# Altium schematic sheet 1_panel.schdoc: Solar Cells
size A4; Engineer: Eng_2_ALT; SheetNumber: 2; SheetTotal: 2; Designed by: Marina Duailibe; Version: v0.1
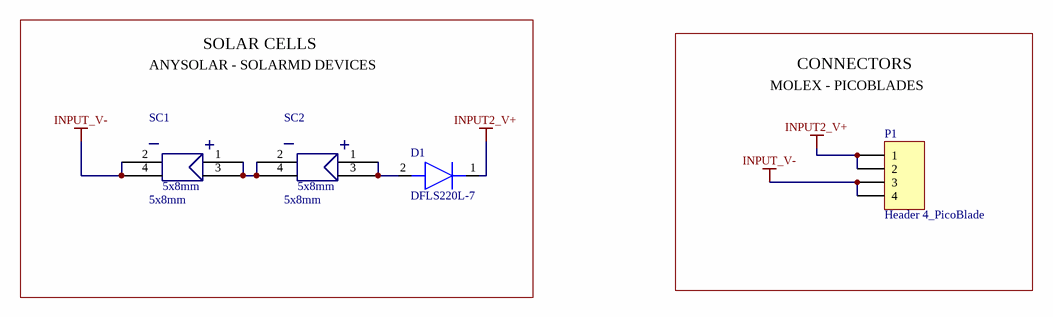
[diagram p0: 1_panel.schdoc]

## Parts
D1  DFLS220L-7  [DFLS220L7]
P1  Header 4_PicoBlade  [PICOBLADE 4PIN VERTICAL - duplicate]
SC1  5x8mm  [SOLAR_CELL]
SC2  5x8mm  [SOLAR_CELL]

## Blocks framed on the sheet
SOLAR CELLS: D1 SC1 SC2
CONNECTORS: P1

## Nets
INPUT2_V+: D1.1(K) P1.1 P1.2
INPUT_V-: P1.3 P1.4 SC1.2(V-) SC1.4
NetD1_2: D1.2(A) SC2.1(V+) SC2.3
NetSC1_1: SC1.1(V+) SC1.3 SC2.2(V-) SC2.4

## Notes on the sheet
- ANYSOLAR - SOLARMD DEVICES
- MOLEX - PICOBLADES
- Project:
- SpaceLab - Federal University of Santa Catarina
- Title:
- Designed by:
- Project Code:
- Date:
- Revision:
- Sheet
- of
- Size:
- A4
- (in symbol SOLAR CELL) _; +

## Library data of the parts
D1 = DFLS220L-7: Diode; Manufacturer_Name: Diodes Incorporated; Datasheet Link: https://www.diodes.com//assets/Datasheets/DFLS220L.pdf; Height: 1mm; Manufacturer_Part_Number: DFLS220L-7; Mouser Part Number: 621-DFLS220L-7; Mouser Price/Stock: https://www.mouser.co.uk/ProductDetail/Diodes-Incorporated/DFLS220L-7?qs=JV7lzlMm3yKg8xIxKLbqeg%3D%3D; Arrow Part Number: DFLS220L-7; Arrow Price/Stock: https://www.arrow.com/en/products/dfls220l-7/diodes-incorporated?region=nac
P1 = Header 4_PicoBlade: Header, 4-Pin; PartNumber: 53398-0471; Manufacturer: Molex; Body Plating: Tin; Contact Resistance: 20mR; Current Rating: 1A; Gender: Male; Glow Wire Compliant: Non-compliant; Insulation Resistance: 100MR; Number of Circuits: 4; Pitch: 1.25mm; Voltage Rating (AC): 125V; LatestRevisionDate: 17-Jul-2002; LatestRevisionNote: Re-released for DXP Platform.; Publisher: Altium Limited; Color: Natural; ComponentLink1Description: http://www.mouser.com/ds/2/276/0533980471_PCB_HEADERS-171069.pdf?src-supplier=Mouser; ComponentLink1URL: http://www.mouser.com/ds/2/276/0533980471_PCB_HEADERS-171069.pdf?src-supplier=Mouser; ComponentLink2Description: http://www.jameco.com/Jameco/Products/ProdDS/1932627.pdf?src-supplier=Jameco; ComponentLink2URL: http://www.jameco.com/Jameco/Products/ProdDS/1932627.pdf?src-supplier=Jameco; ComponentLink3Description: https://www.distrelec.biz/Web/Downloads/46/_e/gf116833-116846_e.pdf?mime=application%2Fpdf&src-supplier=Distrelec; ComponentLink3URL: https://www.distrelec.biz/Web/Downloads/46/_e/gf116833-116846_e.pdf?mime=application%2Fpdf&src-supplier=Distrelec; ComponentLink4Description: http://www.molex.com/webdocs/datasheets/pdf/en-us/0533980471_PCB_HEADERS.pdf?src-supplier=Element14; ComponentLink4URL: http://www.molex.com/webdocs/datasheets/pdf/en-us/0533980471_PCB_HEADERS.pdf?src-supplier=Element14; ComponentLink5Description: http://www.farnell.com/datasheets/1867381.pdf?src-supplier=Element14; ComponentLink5URL: http://www.farnell.com/datasheets/1867381.pdf?src-supplier=Element14; ComponentLink6Description: http://uk.rs-online.com/webdocs/13c4/0900766b813c4500.pdf?src-supplier=RSComponents; ComponentLink6URL: http://uk.rs-online.com/webdocs/13c4/0900766b813c4500.pdf?src-supplier=RSComponents; ComponentLink7Description: http://www.molex.com/webdocs/datasheets/pdf/en-us/0533980471_PCB_HEADERS.pdf?src-supplier=Farnell; ComponentLink7URL: http://www.molex.com/webdocs/datasheets/pdf/en-us/0533980471_PCB_HEADERS.pdf?src-supplier=Farnell; ComponentLink8Description: http://www.farnell.com/datasheets/2697809.pdf?src-supplier=Element14; ComponentLink8URL: http://www.farnell.com/datasheets/2697809.pdf?src-supplier=Element14; ComponentLink9Description: http://www.molex.com/webdocs/datasheets/pdf/en-us/0533980471_PCB_HEADERS.pdf?src-supplier=Avnet; ComponentLink9URL: http://www.molex.com/webdocs/datasheets/pdf/en-us/0533980471_PCB_HEADERS.pdf?src-supplier=Avnet; ComponentLink10Description: http://www.molex.com/webdocs/datasheets/pdf/en-us/0533980471_PCB_HEADERS.pdf?src-supplier=Avnet+Europe; ComponentLink10URL: http://www.molex.com/webdocs/datasheets/pdf/en-us/0533980471_PCB_HEADERS.pdf?src-supplier=Avnet+Europe; Contact Material: Bronze,Tin,Brass; Contact Plating: Tin; Flammability Rating: UL94 V-0; Housing Color: Natural; Housing Material: Nylon; Lead Free: Lead Free; Lead Pitch: 1.25mm; Manufacturer Part Number: 53398-0471; Max Operating Temperature: 85°C; Min Operating Temperature: -40°C; Mount: Surface Mount; Number of Contacts: 4; Number of Positions: 4; Number of Rows: 1; Orientation: Vertical; Package Quantity: 1000; Packaging: Tape and Reel; Pricing 1: 1=0.98, 10=0.832, 100=0.716, 500=0.6, 1000=0.391, 2000=0.342 (USD); Pricing 2: 1=1.19, 10=1.044, 100=0.901, 500=0.73716 (USD); Radiation Hardening: No; REACH SVHC: Unknown; Stock 1: 43251; Stock 2: 20817; Supplier 1: Mouser; Supplier 2: Digi-Key; Supplier Part Number 1: 538-53398-0471; Supplier Part Number 2: WM7608CT-ND; Termination: Solder; Voltage Rating (DC): 125V; Voltage Rating: 125V; Working Voltage: 125V
SC1 SC2 = SOLAR CELL: Manufacturer: Yim Space; PDM Number: SC-3GA-3